# Altium project TelemetryBoard.PrjPcb
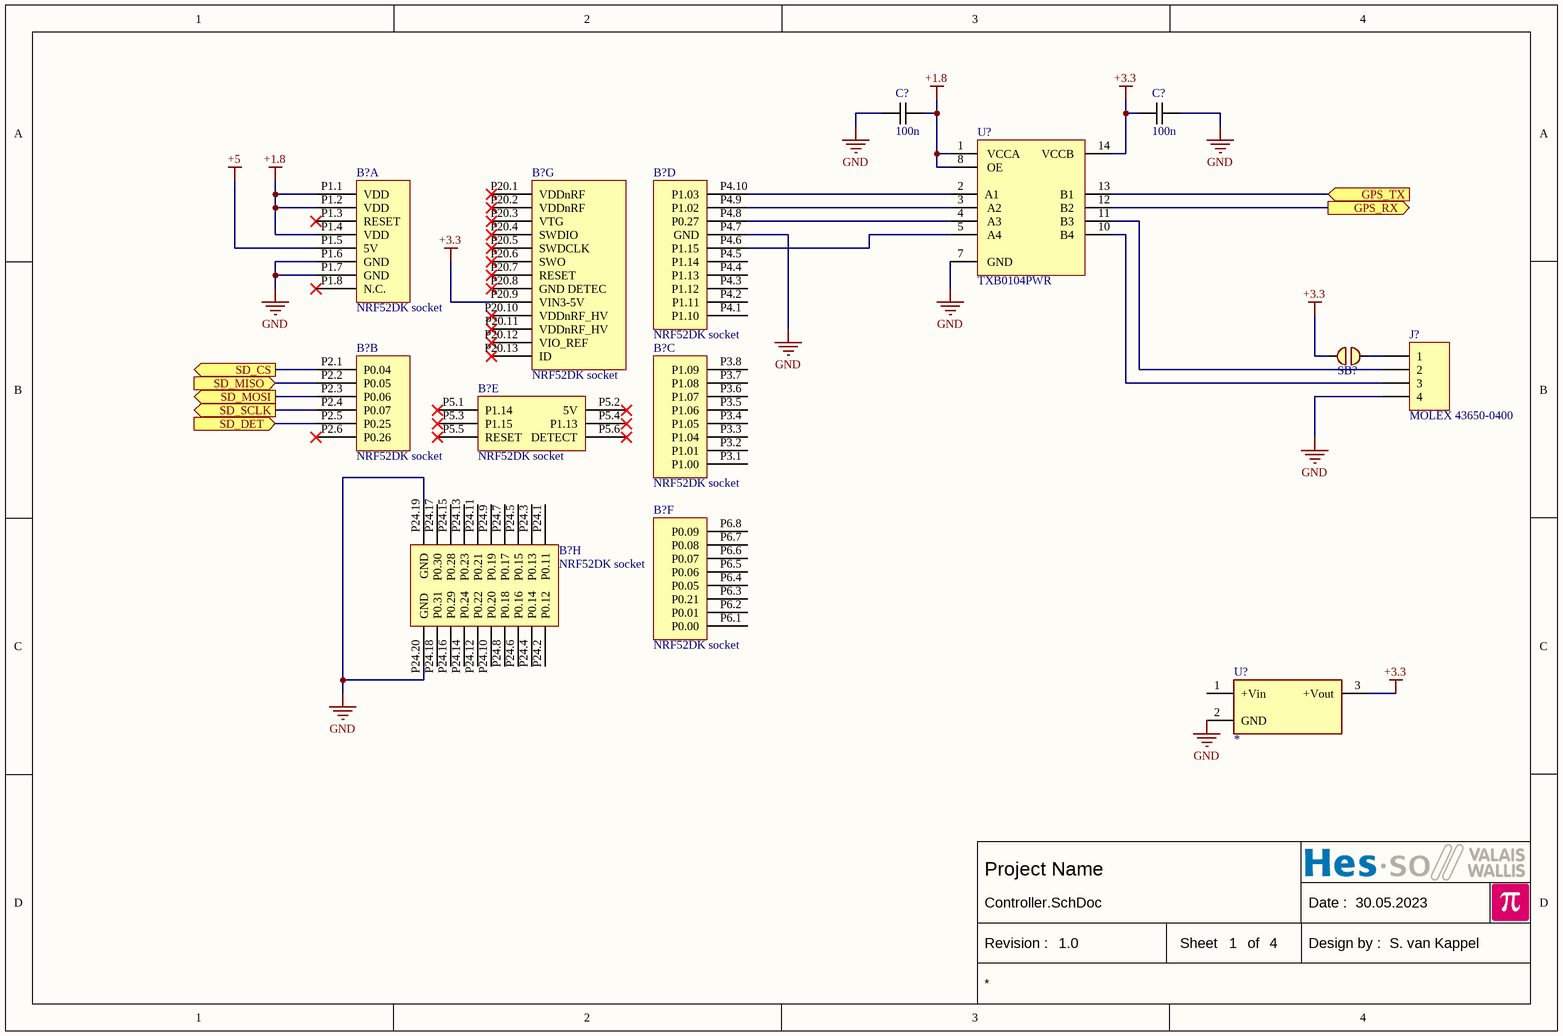
[diagram p0: Controller.SchDoc]
PcbDate: dd.mm.yyyyy; PcbDesigner: name; PcbRevision: 1.0; SchematicDate: 30.05.2023; SchematicDesigner: S. van Kappel; SchematicRevision: 1.0
4 sheets, 42 parts. Net scope: flat (ports and power ports of the same name join across sheets).
Sheets:
  Controller.SchDoc
  SDCard.SchDoc
  CanController.SchDoc
  gps.SchDoc

## Sheet Controller.SchDoc
size A4; Date: Date; CompanyName: HESSO; Engineer: Name; Address1: Route du Rawyl 47; Address2: 1950 Sion; Address3: Switzerland; DocumentNumber: 3; SheetNumber: 1; SheetTotal: 4; ProjectName: Project Name

### Parts
(Parts that share a designator on the sheet are numbered #1, #2 ... from top to bottom, then left to right.)
B?#1  NRF52DK socket  [nRF5340DK SOCKET]  (part A of 8)
B?#2  NRF52DK socket  [nRF5340DK SOCKET]  (part G of 8)
B?#3  NRF52DK socket  [nRF5340DK SOCKET]  (part D of 8)
B?#4  NRF52DK socket  [nRF5340DK SOCKET]  (part B of 8)
B?#5  NRF52DK socket  [nRF5340DK SOCKET]  (part E of 8)
B?#6  NRF52DK socket  [nRF5340DK SOCKET]  (part C of 8)
B?#7  NRF52DK socket  [nRF5340DK SOCKET]  (part H of 8)
B?#8  NRF52DK socket  [nRF5340DK SOCKET]  (part F of 8)
C?#1  100n  [CAPACITOR 1608 REFLOW]
C?#2  100n  [CAPACITOR 1608 REFLOW]
J?#1  MOLEX 43650-0400  [MOLEX 43650-0400]
SB?  *  [Solder Bridge 1mm Unconnected]  (value not drawn)  (net tie, no BOM)
U?#1  TXB0104PWR  [TSSOP14 P0.65 C4.4x5.0 H1.1]
U?#2  *  [TRACO TSR 1]

### Ports
GPS_RX (out), GPS_TX (in), SD_CS (out), SD_DET (in), SD_MISO (in), SD_MOSI (out), SD_SCLK (out)

### Nets
+1.8: B?#1.P1.1(VDD) B?#1.P1.2(VDD) B?#1.P1.4(VDD) C?#1.1 U?#1.1(VCCA) U?#1.8(OE)
+3.3: B?#2.P20.9(VIN3-5V) C?#2.2 SB?.2 U?#1.14(VCCB) U?#2.3(+Vout)
+5: B?#1.P1.5(5V)
GND: B?#1.P1.6(GND) B?#1.P1.7(GND) B?#3.P4.7(GND) B?#7.P24.19(GND) B?#7.P24.20(GND) C?#1.2 C?#2.1 J?#1.4 U?#1.7(GND) U?#2.2(GND)
NetB?#3_P4.6: B?#3.P4.6(P1.15) U?#1.5(A4)
NetB?#3_P4.8: B?#3.P4.8(P0.27) U?#1.4(A3)
NetB?#3_P4.9: B?#3.P4.9(P1.02) U?#1.3(A2)
NetB?#3_P4.10: B?#3.P4.10(P1.03) U?#1.2(A1)
NetB?#4_P2.1: B?#4.P2.1(P0.04) ; port SD_CS
NetB?#4_P2.2: B?#4.P2.2(P0.05) ; port SD_MISO
NetB?#4_P2.3: B?#4.P2.3(P0.06) ; port SD_MOSI
NetB?#4_P2.4: B?#4.P2.4(P0.07) ; port SD_SCLK
NetB?#4_P2.5: B?#4.P2.5(P0.25) ; port SD_DET
NetJ?#1_1: J?#1.1 SB?.1
NetJ?#1_2: J?#1.2 U?#1.11(B3)
NetJ?#1_3: J?#1.3 U?#1.10(B4)
NetJP?#2_1: U?#1.12(B2) ; port GPS_RX
NetJP?#3_1: U?#1.13(B1) ; port GPS_TX

Not connected (* = marked no-connect by the designer): B?#1 P1.3(RESET)* P1.8(N.C.)*; B?#2 P20.1(VDDnRF)* P20.2(VDDnRF)* P20.3(VTG)* P20.4(SWDIO)* P20.5(SWDCLK)* P20.6(SWO)* P20.7(RESET)* P20.8(GND_DETEC)* P20.10(VDDnRF_HV)* P20.11(VDDnRF_HV)* P20.12(VIO_REF)* P20.13(ID)*; B?#3 P4.1(P1.10) P4.2(P1.11) P4.3(P1.12) P4.4(P1.13) P4.5(P1.14); B?#4 P2.6(P0.26)*; B?#5 P5.1(P1.14)* P5.2(5V)* P5.3(P1.15)* P5.4(P1.13)* P5.5(RESET)* P5.6(DETECT)*; B?#6 P3.1(P1.00) P3.2(P1.01) P3.3(P1.04) P3.4(P1.05) P3.5(P1.06) P3.6(P1.07) P3.7(P1.08) P3.8(P1.09); B?#7 P24.1(P0.11) P24.2(P0.12) P24.3(P0.13) P24.4(P0.14) P24.5(P0.15) P24.6(P0.16) P24.7(P0.17) P24.8(P0.18) P24.9(P0.19) P24.10(P0.20) P24.11(P0.21) P24.12(P0.22) P24.13(P0.23) P24.14(P0.24) P24.15(P0.28) P24.16(P0.29) P24.17(P0.30) P24.18(P0.31); B?#8 P6.1(P0.00) P6.2(P0.01) P6.3(P0.21) P6.4(P0.05) P6.5(P0.06) P6.6(P0.07) P6.7(P0.08) P6.8(P0.09); U?#2 1(+Vin)

### Notes on the sheet
- Date :
- Revision :
- Sheet
- of
- Design by :

### Library data of the parts
B?#1-B?#8 = nRF5340DK Socket: nRF53 development kit; Value: NRF52DK socket
C?#1 C?#2 = Capacitor: Value: *
J?#1 = MOLEX 43650-0400: Micro-Fit 3.0 Right-Angle Header, 3.00mm Pitch, Single Row, 4 Circuits
SB? = Solderbridge Unconnected: Value: *
U?#1 = TXB0104PWR: 4-Bit Bidirectional Voltage-Level Translator With utomatic Direction Sensing and ±15-kV ESD Protection; Value: TXB0104PWR
U?#2 = TRACO TSR 1: DC/DC Converter; Value: *

## Sheet SDCard.SchDoc
size A4; Date: Date; CompanyName: HESSO; Engineer: Name; Address1: Route du Rawyl 47; Address2: 1950 Sion; Address3: Switzerland; DocumentNumber: 2; SheetNumber: 2; SheetTotal: 4; ProjectName: Project Name
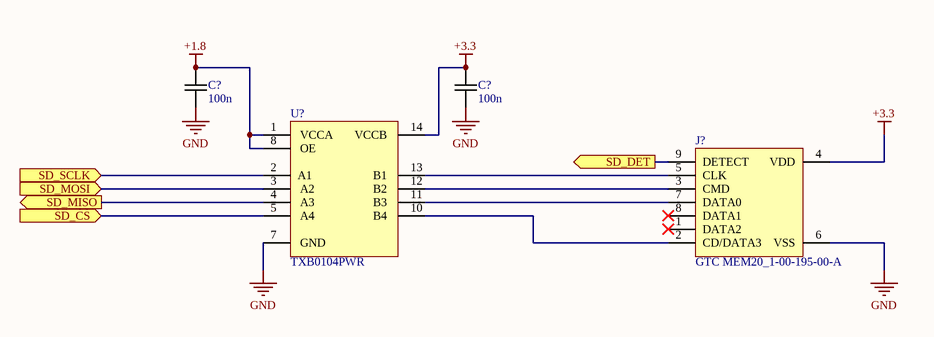
[diagram p1: SDCard.SchDoc]

### Parts
(Parts that share a designator on the sheet are numbered #1, #2 ... from top to bottom, then left to right.)
C?#3  100n  [CAPACITOR 1608 REFLOW]
C?#4  100n  [CAPACITOR 1608 REFLOW]
J?#2  GTC MEM20_1-00-195-00-A  [SD MICRO GCT MEM2051-00-195-00-A]
U?#3  TXB0104PWR  [TSSOP14 P0.65 C4.4x5.0 H1.1]

### Ports
SD_CS (in), SD_DET (out), SD_MISO (out), SD_MOSI (in), SD_SCLK (in)

### Nets
+1.8: C?#3.2 U?#3.1(VCCA) U?#3.8(OE)
+3.3: C?#4.2 J?#2.4(VDD) U?#3.14(VCCB)
GND: C?#3.1 C?#4.1 J?#2.6(VSS) U?#3.7(GND)
NetB?#4_P2.1: U?#3.5(A4) ; port SD_CS
NetB?#4_P2.2: U?#3.4(A3) ; port SD_MISO
NetB?#4_P2.3: U?#3.3(A2) ; port SD_MOSI
NetB?#4_P2.4: U?#3.2(A1) ; port SD_SCLK
NetB?#4_P2.5: J?#2.9(DETECT) ; port SD_DET
NetJ?#2_2: J?#2.2(CD/DATA3) U?#3.10(B4)
NetJ?#2_3: J?#2.3(CMD) U?#3.12(B2)
NetJ?#2_5: J?#2.5(CLK) U?#3.13(B1)
NetJ?#2_7: J?#2.7(DATA0) U?#3.11(B3)

Not connected (* = marked no-connect by the designer): J?#2 1(DATA2)* 8(DATA1)*

### Notes on the sheet
- Date :
- Revision :
- Sheet
- of
- Design by :

### Library data of the parts
C?#3 C?#4 = Capacitor: Value: *
J?#2 = SD-MICRO GTC MEM20_1-00-195-00-A: SD Card Micro; MF: Global Connector Technology; MP: MEM2051-00-195-00-A; Purchase-URL: https://pricing.snapeda.com/search/part/MEM2051-00-195-00-A/?ref=eda; Price: None; SnapEDA_Link: https://www.snapeda.com/parts/MEM2051-00-195-00-A/Global%20Connector%20Technology/view-part/779220/?ref=snap; Check_prices: https://www.snapeda.com/parts/MEM2051-00-195-00-A/Global%20Connector%20Technology/view-part/779220/?ref=eda; Package: None; Value: GTC MEM20_1-00-195-00-A; Availability: Warning
U?#3 = TXB0104PWR: as U?#1 on sheet Controller; Value: TXB0104PWR

## Sheet CanController.SchDoc
size A4; CompanyName: HESSO; Address1: Route du Rawyl 47; Address2: 1950 Sion; Address3: Switzerland; DocumentNumber: 4; SheetNumber: 3; SheetTotal: 4; PageSetup: Record=PageOptions|CenterHorizontal=True|CenterVertical=True|PrintScale=1.00|XCorrection=1.00|YCorrection=1.00|PrintKind=1|BorderSize=5000000|LeftOffset=0|BottomOffset=0|Orientation=2|PaperLength=1000|PaperWidth=1000|Scale=100|PaperSource=15|PrintQuality=1200|MediaType=1|DitherType=10|PrintScaleMode=1|PaperKind=A4|PaperIndex=9; ProjectName: Project Name
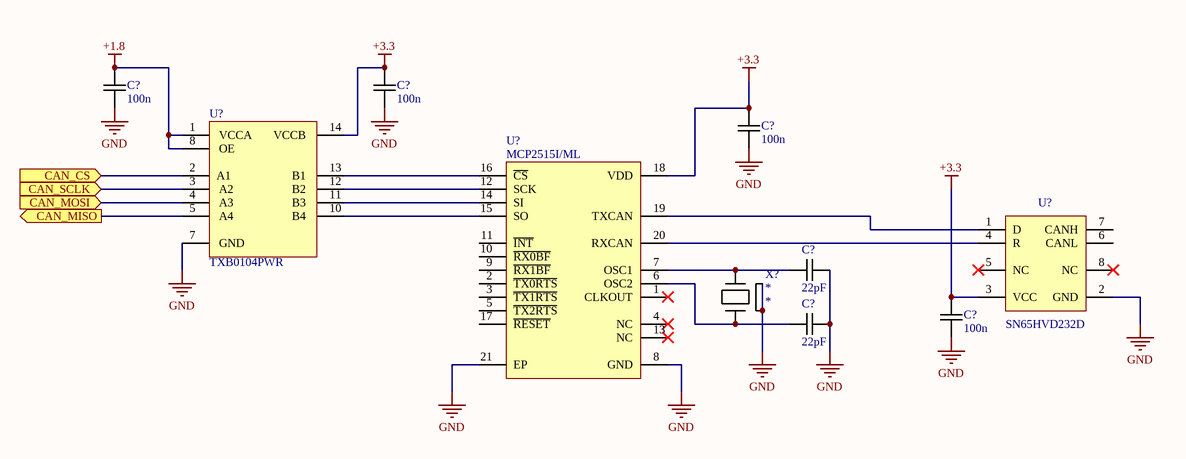
[diagram p2: CanController.SchDoc]

### Parts
(Parts that share a designator on the sheet are numbered #1, #2 ... from top to bottom, then left to right.)
C?#5  100n  [CAPACITOR 1608 REFLOW]
C?#6  100n  [CAPACITOR 1608 REFLOW]
C?#7  100n  [CAPACITOR 1608 REFLOW]
C?#8  22pF  [CAPACITOR 1608 REFLOW]
C?#9  22pF  [CAPACITOR 1608 REFLOW]
C?#10  100n  [CAPACITOR 1608 REFLOW]
U?#4  TXB0104PWR  [TSSOP14 P0.65 C4.4x5.0 H1.1]
U?#5  MCP2515I/ML  [QFN20 P0.5 T2.05x2.05 C4.0x4.0 H0.85]
U?#6  SN65HVD232D  [SO8 P1.27 C4.0X5.0 H1.75]
X?  *  [CRYSTAL C3.2x2.5 Kyocera CX3225SB]

### Ports
CAN_CS (in), CAN_MISO (out), CAN_MOSI (in), CAN_SCLK (in)

### Nets
+1.8: C?#5.2 U?#4.1(VCCA) U?#4.8(OE)
+3.3: C?#6.2 C?#7.2 C?#10.2 U?#4.14(VCCB) U?#5.18(VDD) U?#6.3(VCC)
GND: C?#5.1 C?#6.1 C?#7.1 C?#8.1 C?#9.1 C?#10.1 U?#4.7(GND) U?#5.8(GND) U?#5.21(EP) U?#6.2(GND) X?.2 X?.4
NetC?#8_2: C?#8.2 U?#5.7(OSC1) X?.3
NetC?#9_2: C?#9.2 U?#5.6(OSC2) X?.1
NetU?#4_2: U?#4.2(A1) ; port CAN_CS
NetU?#4_3: U?#4.3(A2) ; port CAN_SCLK
NetU?#4_4: U?#4.4(A3) ; port CAN_MOSI
NetU?#4_5: U?#4.5(A4) ; port CAN_MISO
NetU?#4_10: U?#4.10(B4) U?#5.15(SO)
NetU?#4_11: U?#4.11(B3) U?#5.14(SI)
NetU?#4_12: U?#4.12(B2) U?#5.12(SCK)
NetU?#4_13: U?#4.13(B1) U?#5.16(~{CS})
NetU?#5_19: U?#5.19(TXCAN) U?#6.1(D)
NetU?#5_20: U?#5.20(RXCAN) U?#6.4(R)

Not connected (* = marked no-connect by the designer): U?#5 1(CLKOUT)* 2(~{TX0RTS}) 3(~{TX1RTS}) 4(NC)* 5(~{TX2RTS}) 9(~{RX1BF}) 10(~{RX0BF}) 11(~{INT}) 13(NC)* 17(~{RESET}); U?#6 5(NC)* 6(CANL) 7(CANH) 8(NC)*

### Notes on the sheet
- Date :
- Revision :
- Sheet
- of
- Design by :

### Library data of the parts
C?#5-C?#10 = Capacitor: Value: *
U?#4 = TXB0104PWR: as U?#1 on sheet Controller; Value: TXB0104PWR
U?#5 = MCP2515I/ML: Stand-Alone CAN Controller with SPI Interface; Value: MCP2515I/ML
U?#6 = SN65HVD232D: CAN Bus Transceiver 3V3; Value: SN65HVD232D
X? = Crystal C3.2x2.5 Kyocera CX3225SB: Value: *

## Sheet gps.SchDoc
size A3; Date: Date; CompanyName: HESSO; Engineer: Name; Address1: Route du Rawyl 47; Address2: 1950 Sion; Address3: Switzerland; SheetNumber: 4; SheetTotal: 4; ProjectName: Project Name
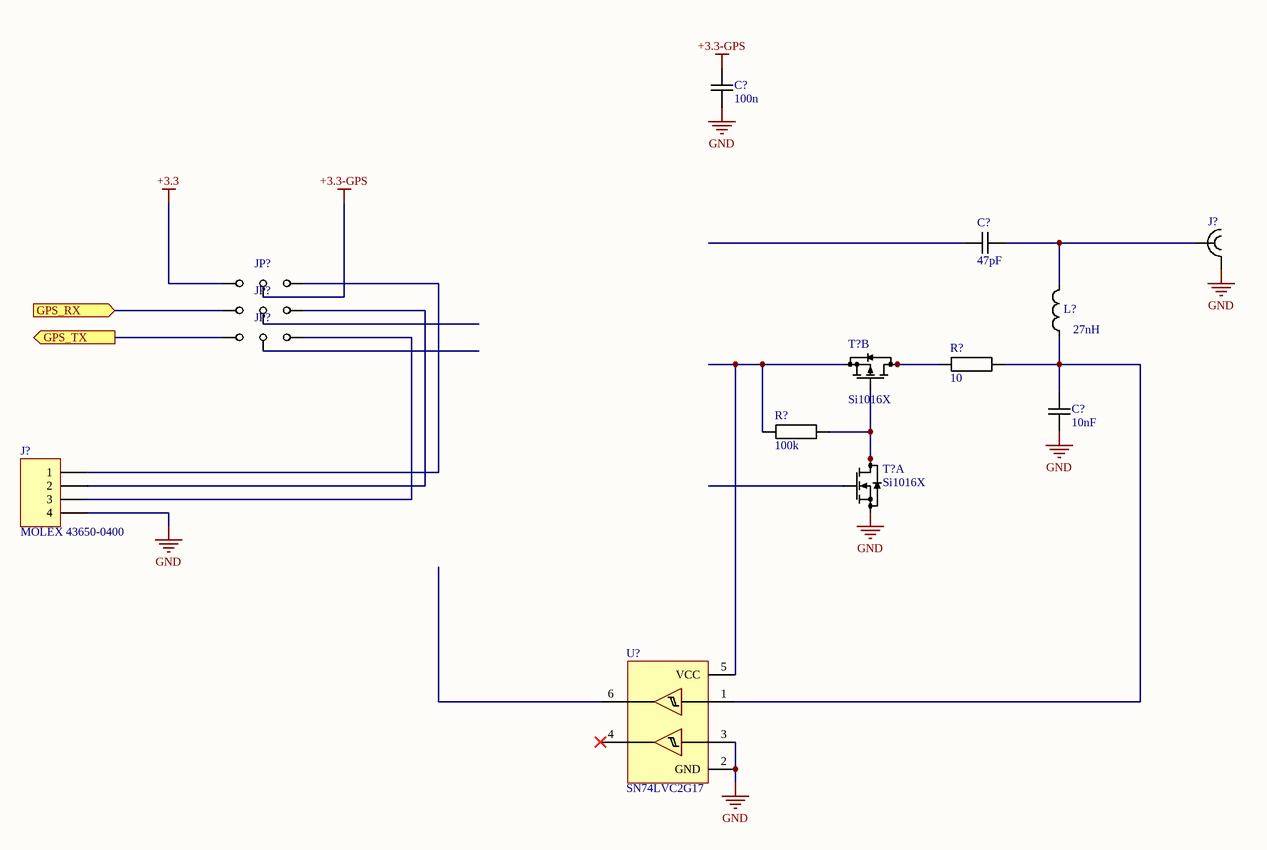
[diagram p3: gps.SchDoc]

### Parts
(Parts that share a designator on the sheet are numbered #1, #2 ... from top to bottom, then left to right.)
C?#11  100n  [CAPACITOR 1608 REFLOW]
C?#12  47pF  [CAPACITOR 1608 REFLOW]
C?#13  10nF  [CAPACITOR 1608 REFLOW]
J?#3  732511150  [SMA EDGE Molex 732511150]  (value not drawn)
J?#4  MOLEX 43650-0400  [MOLEX 43650-0400]
JP?#1  {Value}  [JUMPER3 SMD 1608]  (value not drawn)
JP?#2  {Value}  [JUMPER3 SMD 1608]  (value not drawn)
JP?#3  {Value}  [JUMPER3 SMD 1608]  (value not drawn)
L?  27nH  [INDUCTOR 0603 REFLOW]
R?#1  10  [RESISTOR 1005 REFLOW]
R?#2  100k  [RESISTOR 1005 REFLOW]
T?#1  Si1016X  [SOT563F P0.5 C1.6x1.2 H0.6]  (part B of 2)
T?#2  Si1016X  [SOT563F P0.5 C1.6x1.2 H0.6]  (part A of 2)
U?#7  SN74LVC2G17  [SOT23-6 P0.95 C1.5x3.0 H1.3]

### Ports
GPS_RX (in), GPS_TX (out)

### Nets
+3.3: JP?#1.1
+3.3-GPS: C?#11.2 JP?#1.2
GND: C?#11.1 C?#13.1 J?#3.2 J?#4.4 T?#2.1(S1) U?#7.2(GND) U?#7.3(2A)
NetC?#12_1: C?#12.1 J?#3.1 L?.2
NetC?#13_2: C?#13.2 L?.1 R?#1.2 U?#7.1(1A)
NetJ?#4_1: J?#4.1 JP?#1.3
NetJ?#4_2: J?#4.2 JP?#2.3
NetJ?#4_3: J?#4.3 JP?#3.3
NetJP?#2_1: JP?#2.1 ; port GPS_RX
NetJP?#3_1: JP?#3.1 ; port GPS_TX
NetR?#1_1: R?#1.1 T?#1.3(D2) T?#1.5(D2)
NetR?#2_1: R?#2.1 T?#1.4(S2) U?#7.5(VCC)
NetR?#2_2: R?#2.2 T?#1.5(G2) T?#2.6(D1) T?#2.7(D1)

Not connected (* = marked no-connect by the designer): C?#12 2; JP?#2 2; JP?#3 2; T?#2 2(G1); U?#7 4(2Y)* 6(1Y)

### Notes on the sheet
- Date :
- Revision :
- Sheet
- of
- Design by :

### Library data of the parts
C?#11-C?#13 = Capacitor: Value: *
J?#3 = SMA EDGE Molex 732511150: Value: 732511150
J?#4 = MOLEX 43650-0400: as J?#1 on sheet Controller
JP?#1-JP?#3 = JUMPER 3 POS: Value: {Value}
L? = Inductor: Value: *
R?#1 R?#2 = Resistor: Value: *
T?#1 T?#2 = Si1016X: Complementary N- and P-Channel 20 V (D-S) MOSFET; Value: Si1016X
U?#7 = SN74LVC2G17: Dual Schmitt-Trigger Buffer; Value: SN74LVC2G17

## Nets that join several sheets
+1.8: Controller (6 pins), SDCard (C?#3.2 U?#3.1 U?#3.8), CanController (C?#5.2 U?#4.1 U?#4.8)
+3.3: Controller (5 pins), SDCard (C?#4.2 J?#2.4 U?#3.14), CanController (6 pins), gps (JP?#1.1)
GND: Controller (10 pins), SDCard (C?#3.1 C?#4.1 J?#2.6 U?#3.7), CanController (12 pins), gps (7 pins)
NetB?#4_P2.1: Controller (B?#4.P2.1), SDCard (U?#3.5)
NetB?#4_P2.2: Controller (B?#4.P2.2), SDCard (U?#3.4)
NetB?#4_P2.3: Controller (B?#4.P2.3), SDCard (U?#3.3)
NetB?#4_P2.4: Controller (B?#4.P2.4), SDCard (U?#3.2)
NetB?#4_P2.5: Controller (B?#4.P2.5), SDCard (J?#2.9)
NetJP?#2_1: Controller (U?#1.12), gps (JP?#2.1)
NetJP?#3_1: Controller (U?#1.13), gps (JP?#3.1)